# EasyEDA Pro project ProDoc_v03_01_GLUE_LOGIC_4Plane_2026-09-14.epro

# Board v03_01_GLUE_LOGIC_4Plane
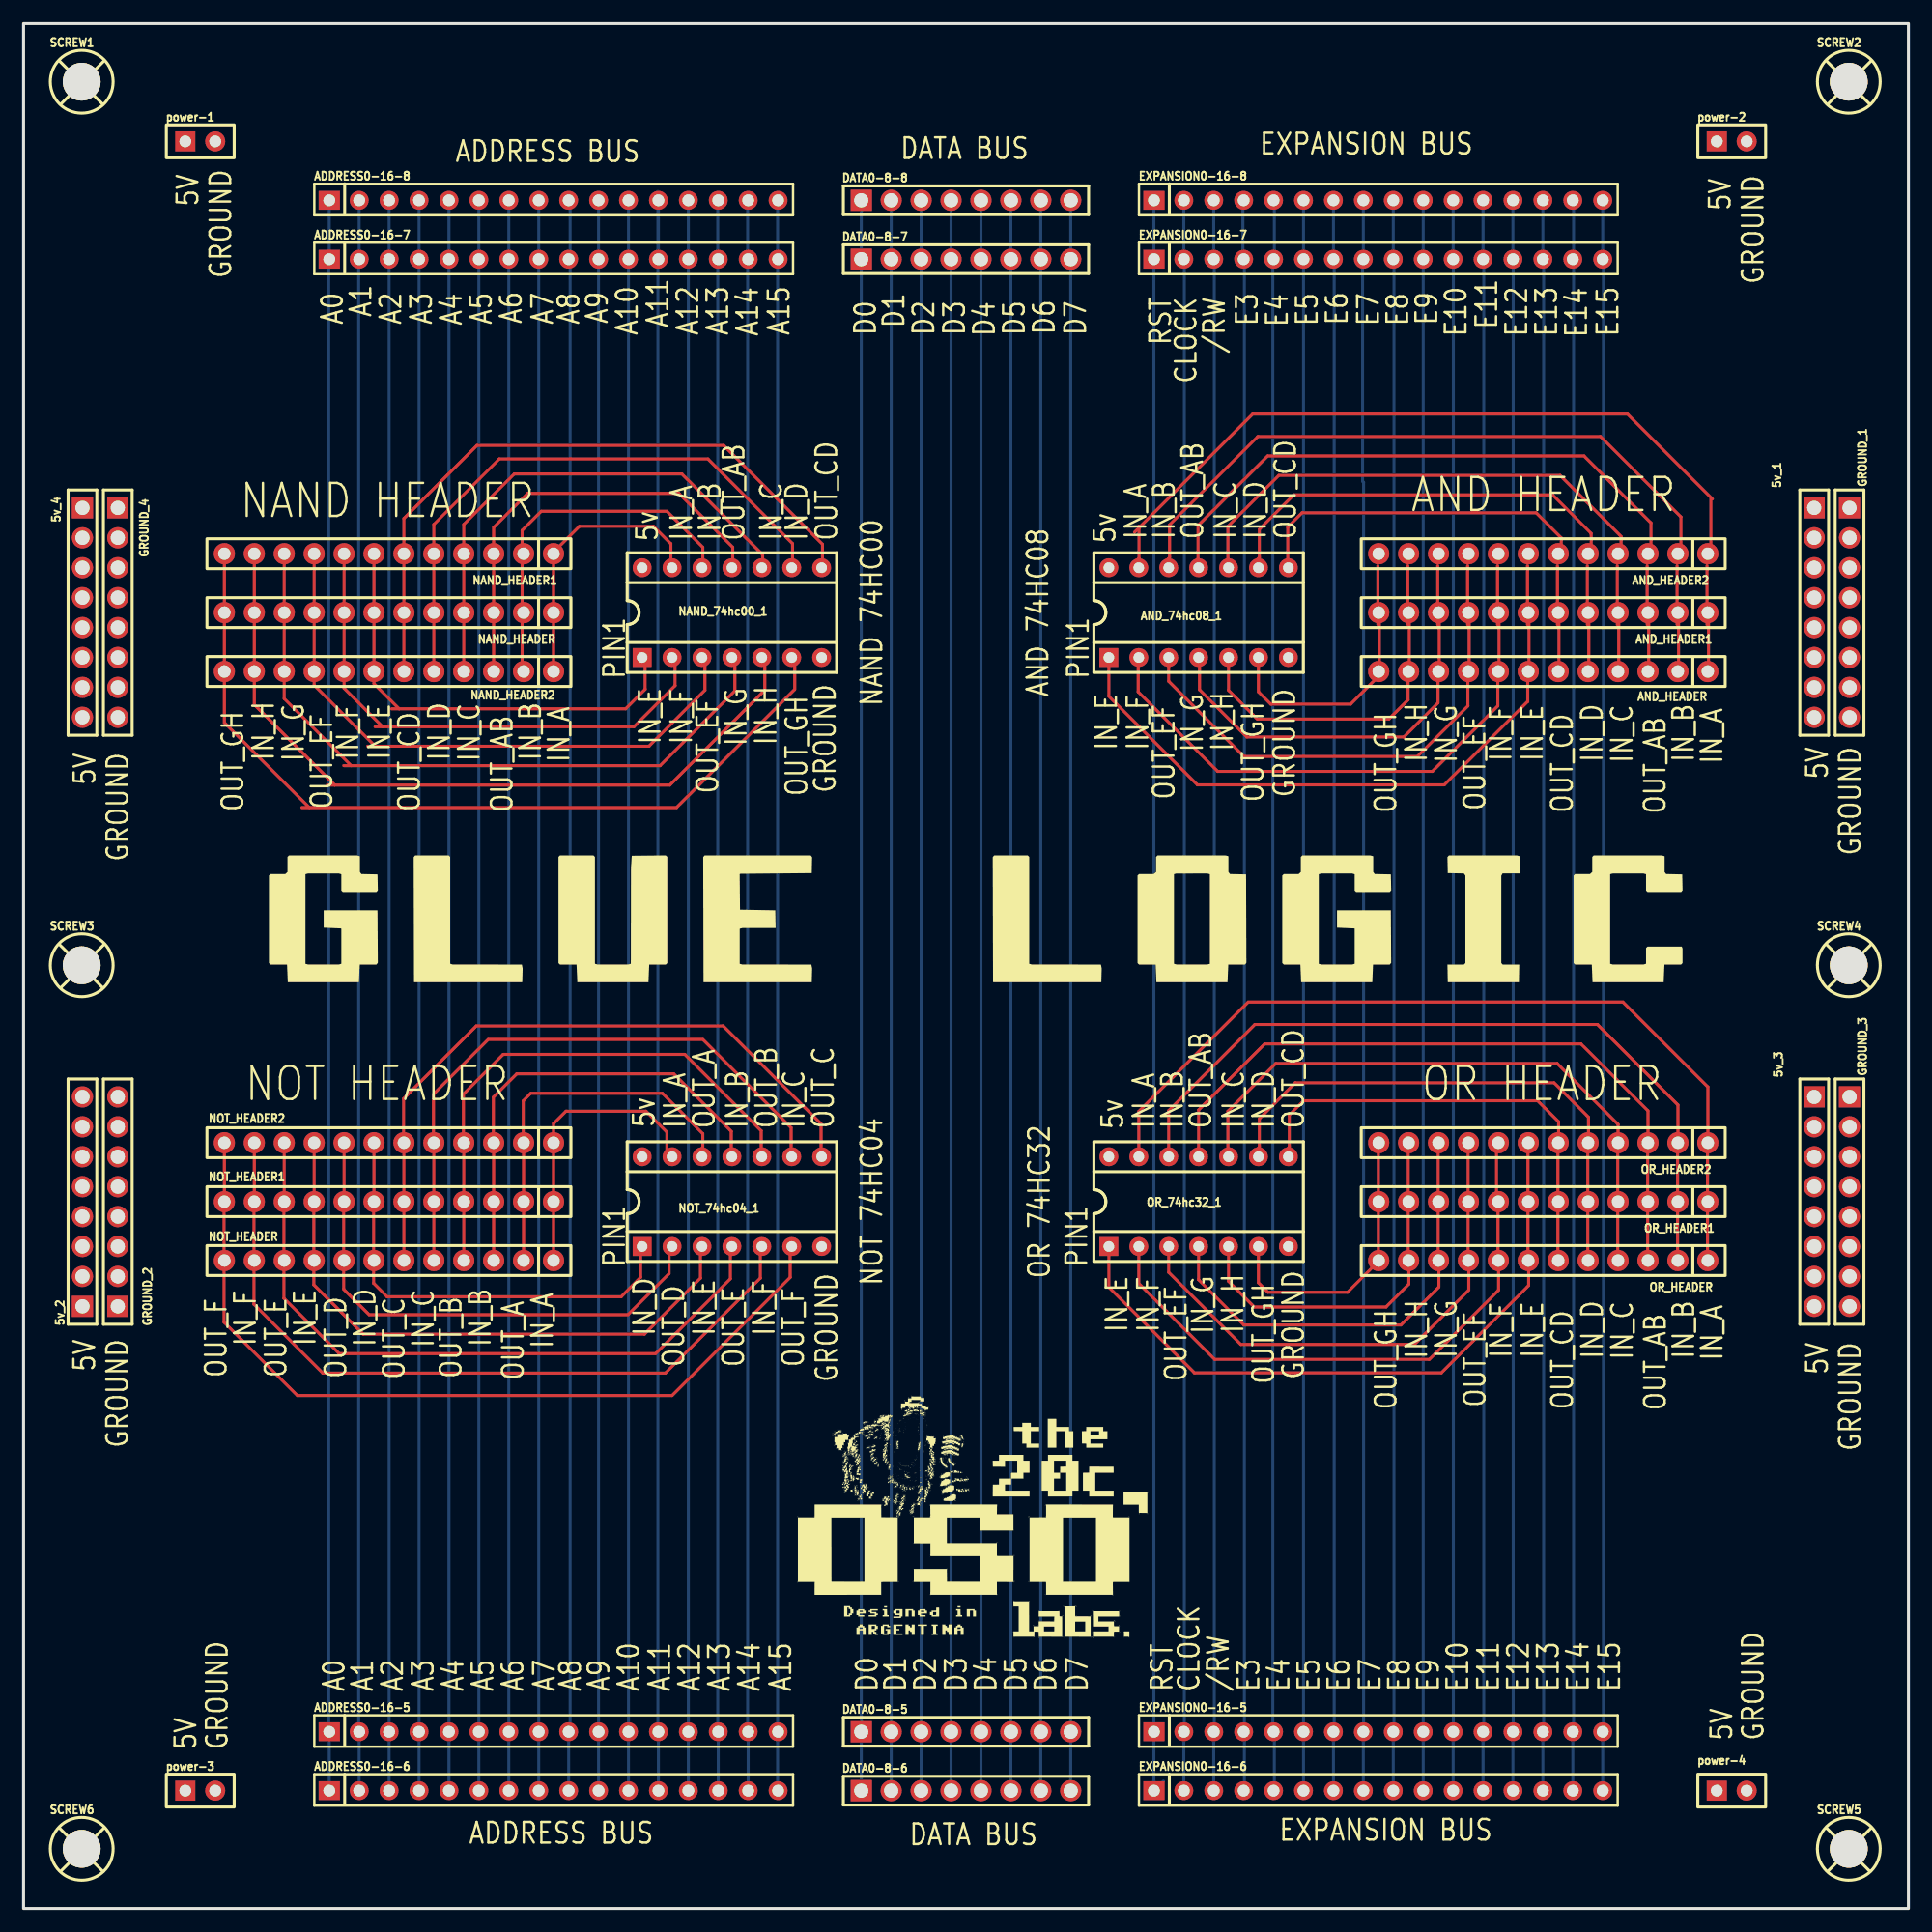
[diagram p0: board, top side]
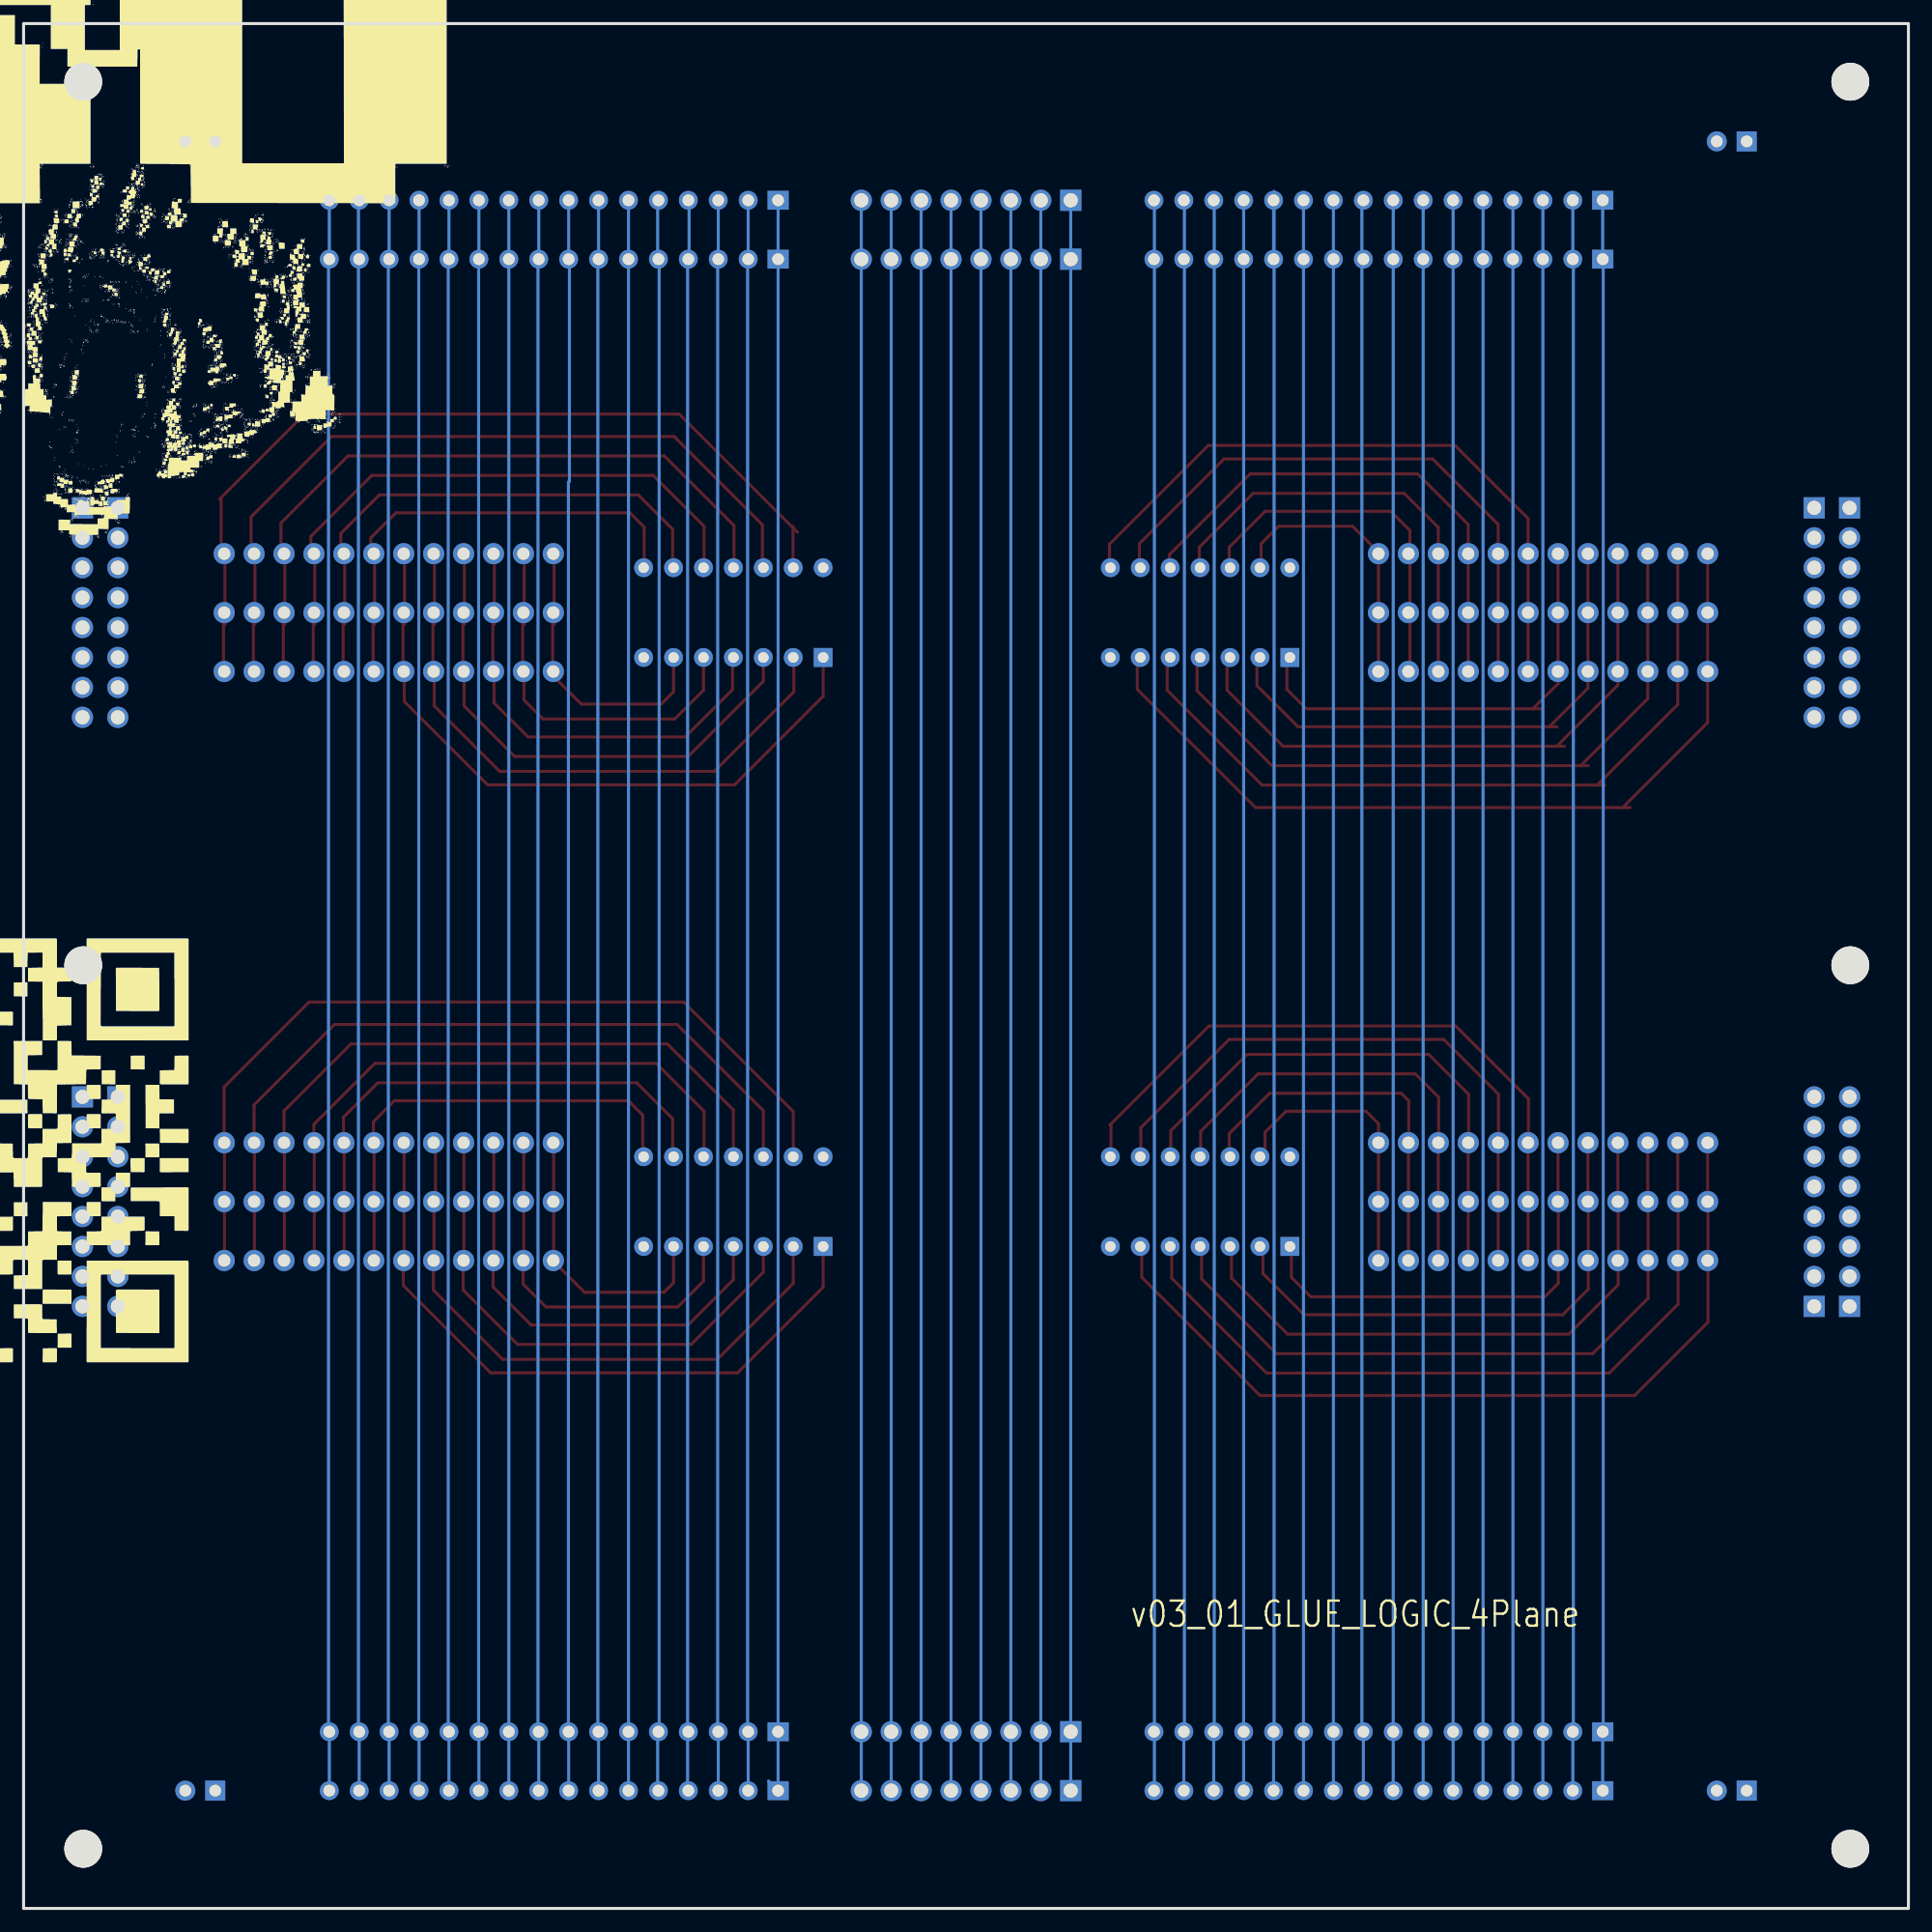
[diagram p1: board, bottom side, seen from below]

Outline 160 x 160 mm; copper layers: Top Layer, GROUND, 5V, Bottom Layer. Coordinates in mm from the lower left corner of the outline.
Outline path: rectangle 0,160 160,0
Stack: Top Layer 0.035mm 外层铜厚1oz / Dielectric1 0.2104mm 7628 RC49% 8.6mil / GROUND 0.0152mm 内层铜厚 / Dielectric2 1.065mm 1.1mm H/HOZ 含铜 / 5V 0.0152mm 内层铜厚 / Dielectric3 0.2104mm 7628 RC49% 8.6mil / Bottom Layer 0.035mm 外层铜厚1oz

## Design rules (mm)
template: JLCPCB Capability(Two Layers Board)
spacing copperThickness1oz (default): track to track 0.102, other pairs 0.152 to 0.3
spacing copperThickness2oz: track to track 0.203, other pairs 0.152 to 0.3
track width copperThickness1oz (default): min 0.127, default 0.254, max 2.54
track width copperThickness2oz: min 0.203, default 0.254, max 2.54
differential pair differentialPair (default): width min 0.127, default 0.254, max 2.54; gap min 0.152, default 0.152
via viaSize (default): diameter min 0.5, default 0.61, max 10; hole min 0.3, default 0.305, max 6.3

## Placement (name value [footprint] x y rotation side)
5v_1  2.54-1*8P母环保  [HDR-TH_8P-P2.54-V-F-1]  152 110 270 top
5v_2  2.54-1*8P母环保  [HDR-TH_8P-P2.54-V-F-1]  5 60 90 top
5v_3  2.54-1*8P母环保  [HDR-TH_8P-P2.54-V-F-1]  152 60 270 top
5v_4  2.54-1*8P母环保  [HDR-TH_8P-P2.54-V-F-1]  5 110 270 top
ADDRESS0-16-5  PM254-1-16-Z-8.5  [HDR-TH_16P-P2.54-V-F-A]  45 15 0 top
ADDRESS0-16-6  PM254-1-16-Z-8.5  [HDR-TH_16P-P2.54-V-F-A]  45 10 0 top
ADDRESS0-16-7  PM254-1-16-Z-8.5  [HDR-TH_16P-P2.54-V-F-A]  45 140 0 top
ADDRESS0-16-8  PM254-1-16-Z-8.5  [HDR-TH_16P-P2.54-V-F-A]  45 145 0 top
AND_74hc08_1  IC-14P窄  [DIP-14_L17.8-W10.2-P2.54-BL]  99.75 110 0 top
AND_HEADER  PM254-1-12-Z-8.5  [HDR-TH_12P-P2.54-V-F]  129 105 180 top
AND_HEADER1  PM254-1-12-Z-8.5  [HDR-TH_12P-P2.54-V-F]  129 110 180 top
AND_HEADER2  PM254-1-12-Z-8.5  [HDR-TH_12P-P2.54-V-F]  129 115 180 top
DATA0-8-5  2.54-1*8P母环保  [HDR-TH_8P-P2.54-V-F-1]  80 15 0 top
DATA0-8-6  2.54-1*8P母环保  [HDR-TH_8P-P2.54-V-F-1]  80 10 0 top
DATA0-8-7  2.54-1*8P母环保  [HDR-TH_8P-P2.54-V-F-1]  80 140 0 top
DATA0-8-8  2.54-1*8P母环保  [HDR-TH_8P-P2.54-V-F-1]  80 145 0 top
EXPANSION0-16-5  PM254-1-16-Z-8.5  [HDR-TH_16P-P2.54-V-F-A]  115 15 0 top
EXPANSION0-16-6  PM254-1-16-Z-8.5  [HDR-TH_16P-P2.54-V-F-A]  115 10 0 top
EXPANSION0-16-7  PM254-1-16-Z-8.5  [HDR-TH_16P-P2.54-V-F-A]  115 140 0 top
EXPANSION0-16-8  PM254-1-16-Z-8.5  [HDR-TH_16P-P2.54-V-F-A]  115 145 0 top
GROUND_1  2.54-1*8P母环保  [HDR-TH_8P-P2.54-V-F-1]  155 110 270 top
GROUND_2  2.54-1*8P母环保  [HDR-TH_8P-P2.54-V-F-1]  8 60 90 top
GROUND_3  2.54-1*8P母环保  [HDR-TH_8P-P2.54-V-F-1]  155 60 270 top
GROUND_4  2.54-1*8P母环保  [HDR-TH_8P-P2.54-V-F-1]  8 110 270 top
NAND_74hc00_1  IC-14P窄  [DIP-14_L17.8-W10.2-P2.54-BL]  60.13 110 0 top
NAND_HEADER  PM254-1-12-Z-8.5  [HDR-TH_12P-P2.54-V-F]  31.02 110 180 top
NAND_HEADER1  PM254-1-12-Z-8.5  [HDR-TH_12P-P2.54-V-F]  31.02 115 180 top
NAND_HEADER2  PM254-1-12-Z-8.5  [HDR-TH_12P-P2.54-V-F]  31.02 105 180 top
NOT_74hc04_1  IC-14P窄  [DIP-14_L17.8-W10.2-P2.54-BL]  60.13 60 0 top
NOT_HEADER  PM254-1-12-Z-8.5  [HDR-TH_12P-P2.54-V-F]  31.02 55 180 top
NOT_HEADER1  PM254-1-12-Z-8.5  [HDR-TH_12P-P2.54-V-F]  31.02 60 180 top
NOT_HEADER2  PM254-1-12-Z-8.5  [HDR-TH_12P-P2.54-V-F]  31.02 65 180 top
OR_74hc32_1  IC-14P窄  [DIP-14_L17.8-W10.2-P2.54-BL]  99.75 60 0 top
OR_HEADER  PM254-1-12-Z-8.5  [HDR-TH_12P-P2.54-V-F]  129 55 180 top
OR_HEADER1  PM254-1-12-Z-8.5  [HDR-TH_12P-P2.54-V-F]  129 60 180 top
OR_HEADER2  PM254-1-12-Z-8.5  [HDR-TH_12P-P2.54-V-F]  129 65 180 top
power-1  2.54-1*2P母  [HDR-TH_2P-P2.54-V-F]  15 150 0 top
power-2  2.54-1*2P母  [HDR-TH_2P-P2.54-V-F]  145 150 0 top
power-3  2.54-1*2P母  [HDR-TH_2P-P2.54-V-F]  15 10 0 top
power-4  2.54-1*2P母  [HDR-TH_2P-P2.54-V-F]  145 10 0 top
SCREW1  -  [Screw-Hole-M3]  5 155 0 top
SCREW2  -  [Screw-Hole-M3]  155 155 0 top
SCREW3  -  [Screw-Hole-M3]  5 80 0 top
SCREW4  -  [Screw-Hole-M3]  155 80 0 top
SCREW5  -  [Screw-Hole-M3]  155 5 0 top
SCREW6  -  [Screw-Hole-M3]  5 5 0 top

## Footprints (pads in the part's own frame, mm; a bottom-side part is the same pattern mirrored in y, then rotated)
DIP-14_L17.8-W10.2-P2.54-BL
  rect 1.6x1.6 hole 0.9: 1(-7.62,-3.81)
  round 1.6 hole 0.9: 2(-5.08,-3.81) 3(-2.54,-3.81) 4(0,-3.81) 5(2.54,-3.81) 6(5.08,-3.81) 7(7.62,-3.81) 8(7.62,3.81) 9(5.08,3.81) 10(2.54,3.81) 11(0,3.81) 12(-2.54,3.81) 13(-5.08,3.81) 14(-7.62,3.81)
HDR-TH_2P-P2.54-V-F
  rect 1.7x1.7 hole 1: 1(-1.27,0)
  round 1.7 hole 1: 2(1.27,0)
HDR-TH_8P-P2.54-V-F-1
  rect 1.8x1.8 hole 1.2: 1(-8.89,0)
  round 1.8 hole 1.2: 2(-6.35,0) 3(-3.81,0) 4(-1.27,0) 5(1.27,0) 6(3.81,0) 7(6.35,0) 8(8.89,0)
HDR-TH_12P-P2.54-V-F
  round 1.8 hole 1.05: 1(-13.97,0) 2(-11.43,0) 3(-8.89,0) 4(-6.35,0) 5(-3.81,0) 6(-1.27,0) 7(1.27,0) 8(3.81,0) 9(6.35,0) 10(8.89,0) 11(11.43,0) 12(13.97,0)
HDR-TH_16P-P2.54-V-F-A
  rect 1.8x1.6 hole 1: 1(-19.05,0)
  round 1.6 hole 1: 2(-16.51,0) 3(-13.97,0) 4(-11.43,0) 5(-8.89,0) 6(-6.35,0) 7(-3.81,0) 8(-1.27,0) 9(1.27,0) 10(3.81,0) 11(6.35,0) 12(8.89,0) 13(11.43,0) 14(13.97,0) 15(16.51,0) 16(19.05,0)
Screw-Hole-M3
  round 3.2 hole 3.2: 1(-0.064,0.064)

## Nets
5V: 5v_1.1 5v_1.2 5v_1.3 5v_1.4 5v_1.5 5v_1.6 5v_1.7 5v_1.8 5v_2.1 5v_2.2 5v_2.3 5v_2.4 5v_2.5 5v_2.6 5v_2.7 5v_2.8 5v_3.1 5v_3.2 5v_3.3 5v_3.4 5v_3.5 5v_3.6 5v_3.7 5v_3.8 5v_4.1 5v_4.2 5v_4.3 5v_4.4 5v_4.5 5v_4.6 5v_4.7 5v_4.8 AND_74hc08_1.14 NAND_74hc00_1.14 NOT_74hc04_1.14 OR_74hc32_1.14 power-1.1 power-2.1 power-3.1 power-4.1
A0: ADDRESS0-16-5.1 ADDRESS0-16-6.1 ADDRESS0-16-7.1 ADDRESS0-16-8.1
A1: ADDRESS0-16-5.2 ADDRESS0-16-6.2 ADDRESS0-16-7.2 ADDRESS0-16-8.2
A2: ADDRESS0-16-5.3 ADDRESS0-16-6.3 ADDRESS0-16-7.3 ADDRESS0-16-8.3
A3: ADDRESS0-16-5.4 ADDRESS0-16-6.4 ADDRESS0-16-7.4 ADDRESS0-16-8.4
A4: ADDRESS0-16-5.5 ADDRESS0-16-6.5 ADDRESS0-16-7.5 ADDRESS0-16-8.5
A5: ADDRESS0-16-5.6 ADDRESS0-16-6.6 ADDRESS0-16-7.6 ADDRESS0-16-8.6
A6: ADDRESS0-16-5.7 ADDRESS0-16-6.7 ADDRESS0-16-7.7 ADDRESS0-16-8.7
A7: ADDRESS0-16-5.8 ADDRESS0-16-6.8 ADDRESS0-16-7.8 ADDRESS0-16-8.8
A8: ADDRESS0-16-5.9 ADDRESS0-16-6.9 ADDRESS0-16-7.9 ADDRESS0-16-8.9
A9: ADDRESS0-16-5.10 ADDRESS0-16-6.10 ADDRESS0-16-7.10 ADDRESS0-16-8.10
A10: ADDRESS0-16-5.11 ADDRESS0-16-6.11 ADDRESS0-16-7.11 ADDRESS0-16-8.11
A11: ADDRESS0-16-5.12 ADDRESS0-16-6.12 ADDRESS0-16-7.12 ADDRESS0-16-8.12
A12: ADDRESS0-16-5.13 ADDRESS0-16-6.13 ADDRESS0-16-7.13 ADDRESS0-16-8.13
A13: ADDRESS0-16-5.14 ADDRESS0-16-6.14 ADDRESS0-16-7.14 ADDRESS0-16-8.14
A14: ADDRESS0-16-5.15 ADDRESS0-16-6.15 ADDRESS0-16-7.15 ADDRESS0-16-8.15
A15: ADDRESS0-16-5.16 ADDRESS0-16-6.16 ADDRESS0-16-7.16 ADDRESS0-16-8.16
AND_IN_A: AND_74hc08_1.13 AND_HEADER.1 AND_HEADER1.1 AND_HEADER2.1
AND_IN_B: AND_74hc08_1.12 AND_HEADER.2 AND_HEADER1.2 AND_HEADER2.2
AND_IN_C: AND_74hc08_1.10 AND_HEADER.4 AND_HEADER1.4 AND_HEADER2.4
AND_IN_D: AND_74hc08_1.9 AND_HEADER.5 AND_HEADER1.5 AND_HEADER2.5
AND_IN_E: AND_74hc08_1.1 AND_HEADER.7 AND_HEADER1.7 AND_HEADER2.7
AND_IN_F: AND_74hc08_1.2 AND_HEADER.8 AND_HEADER1.8 AND_HEADER2.8
AND_IN_G: AND_74hc08_1.4 AND_HEADER.10 AND_HEADER1.10 AND_HEADER2.10
AND_IN_H: AND_74hc08_1.5 AND_HEADER.11 AND_HEADER1.11 AND_HEADER2.11
AND_OUT_AB: AND_74hc08_1.11 AND_HEADER.3 AND_HEADER1.3 AND_HEADER2.3
AND_OUT_CD: AND_74hc08_1.8 AND_HEADER.6 AND_HEADER1.6 AND_HEADER2.6
AND_OUT_EF: AND_74hc08_1.3 AND_HEADER.9 AND_HEADER1.9 AND_HEADER2.9
AND_OUT_GH: AND_74hc08_1.6 AND_HEADER.12 AND_HEADER1.12 AND_HEADER2.12
CLOCK: EXPANSION0-16-5.2 EXPANSION0-16-6.2 EXPANSION0-16-7.2 EXPANSION0-16-8.2
D0: DATA0-8-5.1 DATA0-8-6.1 DATA0-8-7.1 DATA0-8-8.1
D1: DATA0-8-5.2 DATA0-8-6.2 DATA0-8-7.2 DATA0-8-8.2
D2: DATA0-8-5.3 DATA0-8-6.3 DATA0-8-7.3 DATA0-8-8.3
D3: DATA0-8-5.4 DATA0-8-6.4 DATA0-8-7.4 DATA0-8-8.4
D4: DATA0-8-5.5 DATA0-8-6.5 DATA0-8-7.5 DATA0-8-8.5
D5: DATA0-8-5.6 DATA0-8-6.6 DATA0-8-7.6 DATA0-8-8.6
D6: DATA0-8-5.7 DATA0-8-6.7 DATA0-8-7.7 DATA0-8-8.7
D7: DATA0-8-5.8 DATA0-8-6.8 DATA0-8-7.8 DATA0-8-8.8
E3: EXPANSION0-16-5.4 EXPANSION0-16-6.4 EXPANSION0-16-7.4 EXPANSION0-16-8.4
E4: EXPANSION0-16-5.5 EXPANSION0-16-6.5 EXPANSION0-16-7.5 EXPANSION0-16-8.5
E5: EXPANSION0-16-5.6 EXPANSION0-16-6.6 EXPANSION0-16-7.6 EXPANSION0-16-8.6
E6: EXPANSION0-16-5.7 EXPANSION0-16-6.7 EXPANSION0-16-7.7 EXPANSION0-16-8.7
E7: EXPANSION0-16-5.8 EXPANSION0-16-6.8 EXPANSION0-16-7.8 EXPANSION0-16-8.8
E8: EXPANSION0-16-5.9 EXPANSION0-16-6.9 EXPANSION0-16-7.9 EXPANSION0-16-8.9
E9: EXPANSION0-16-5.10 EXPANSION0-16-6.10 EXPANSION0-16-7.10 EXPANSION0-16-8.10
E10: EXPANSION0-16-5.11 EXPANSION0-16-6.11 EXPANSION0-16-7.11 EXPANSION0-16-8.11
E11: EXPANSION0-16-5.12 EXPANSION0-16-6.12 EXPANSION0-16-7.12 EXPANSION0-16-8.12
E12: EXPANSION0-16-5.13 EXPANSION0-16-6.13 EXPANSION0-16-7.13 EXPANSION0-16-8.13
E13: EXPANSION0-16-5.14 EXPANSION0-16-6.14 EXPANSION0-16-7.14 EXPANSION0-16-8.14
E14: EXPANSION0-16-5.15 EXPANSION0-16-6.15 EXPANSION0-16-7.15 EXPANSION0-16-8.15
E15: EXPANSION0-16-5.16 EXPANSION0-16-6.16 EXPANSION0-16-7.16 EXPANSION0-16-8.16
GROUND: AND_74hc08_1.7 GROUND_1.1 GROUND_1.2 GROUND_1.3 GROUND_1.4 GROUND_1.5 GROUND_1.6 GROUND_1.7 GROUND_1.8 GROUND_2.1 GROUND_2.2 GROUND_2.3 GROUND_2.4 GROUND_2.5 GROUND_2.6 GROUND_2.7 GROUND_2.8 GROUND_3.1 GROUND_3.2 GROUND_3.3 GROUND_3.4 GROUND_3.5 GROUND_3.6 GROUND_3.7 GROUND_3.8 GROUND_4.1 GROUND_4.2 GROUND_4.3 GROUND_4.4 GROUND_4.5 GROUND_4.6 GROUND_4.7 GROUND_4.8 NAND_74hc00_1.7 NOT_74hc04_1.7 OR_74hc32_1.7 power-1.2 power-2.2 power-3.2 power-4.2
NAND_IN_A: NAND_74hc00_1.13 NAND_HEADER.1 NAND_HEADER1.1 NAND_HEADER2.1
NAND_IN_B: NAND_74hc00_1.12 NAND_HEADER.2 NAND_HEADER1.2 NAND_HEADER2.2
NAND_IN_C: NAND_74hc00_1.10 NAND_HEADER.4 NAND_HEADER1.4 NAND_HEADER2.4
NAND_IN_D: NAND_74hc00_1.9 NAND_HEADER.5 NAND_HEADER1.5 NAND_HEADER2.5
NAND_IN_E: NAND_74hc00_1.1 NAND_HEADER.7 NAND_HEADER1.7 NAND_HEADER2.7
NAND_IN_F: NAND_74hc00_1.2 NAND_HEADER.8 NAND_HEADER1.8 NAND_HEADER2.8
NAND_IN_G: NAND_74hc00_1.4 NAND_HEADER.10 NAND_HEADER1.10 NAND_HEADER2.10
NAND_IN_H: NAND_74hc00_1.5 NAND_HEADER.11 NAND_HEADER1.11 NAND_HEADER2.11
NAND_OUT_AB: NAND_74hc00_1.11 NAND_HEADER.3 NAND_HEADER1.3 NAND_HEADER2.3
NAND_OUT_CD: NAND_74hc00_1.8 NAND_HEADER.6 NAND_HEADER1.6 NAND_HEADER2.6
NAND_OUT_EF: NAND_74hc00_1.3 NAND_HEADER.9 NAND_HEADER1.9 NAND_HEADER2.9
NAND_OUT_GH: NAND_74hc00_1.6 NAND_HEADER.12 NAND_HEADER1.12 NAND_HEADER2.12
NOT_IN_A: NOT_74hc04_1.13 NOT_HEADER.1 NOT_HEADER1.1 NOT_HEADER2.1
NOT_IN_B: NOT_74hc04_1.11 NOT_HEADER.3 NOT_HEADER1.3 NOT_HEADER2.3
NOT_IN_C: NOT_74hc04_1.9 NOT_HEADER.5 NOT_HEADER1.5 NOT_HEADER2.5
NOT_IN_D: NOT_74hc04_1.1 NOT_HEADER.7 NOT_HEADER1.7 NOT_HEADER2.7
NOT_IN_E: NOT_74hc04_1.3 NOT_HEADER.9 NOT_HEADER1.9 NOT_HEADER2.9
NOT_IN_F: NOT_74hc04_1.5 NOT_HEADER.11 NOT_HEADER1.11 NOT_HEADER2.11
NOT_OUT_A: NOT_74hc04_1.12 NOT_HEADER.2 NOT_HEADER1.2 NOT_HEADER2.2
NOT_OUT_B: NOT_74hc04_1.10 NOT_HEADER.4 NOT_HEADER1.4 NOT_HEADER2.4
NOT_OUT_C: NOT_74hc04_1.8 NOT_HEADER.6 NOT_HEADER1.6 NOT_HEADER2.6
NOT_OUT_D: NOT_74hc04_1.2 NOT_HEADER.8 NOT_HEADER1.8 NOT_HEADER2.8
NOT_OUT_E: NOT_74hc04_1.4 NOT_HEADER.10 NOT_HEADER1.10 NOT_HEADER2.10
NOT_OUT_F: NOT_74hc04_1.6 NOT_HEADER.12 NOT_HEADER1.12 NOT_HEADER2.12
OR_IN_A: OR_74hc32_1.13 OR_HEADER.1 OR_HEADER1.1 OR_HEADER2.1
OR_IN_B: OR_74hc32_1.12 OR_HEADER.2 OR_HEADER1.2 OR_HEADER2.2
OR_IN_C: OR_74hc32_1.10 OR_HEADER.4 OR_HEADER1.4 OR_HEADER2.4
OR_IN_D: OR_74hc32_1.9 OR_HEADER.5 OR_HEADER1.5 OR_HEADER2.5
OR_IN_E: OR_74hc32_1.1 OR_HEADER.7 OR_HEADER1.7 OR_HEADER2.7
OR_IN_F: OR_74hc32_1.2 OR_HEADER.8 OR_HEADER1.8 OR_HEADER2.8
OR_IN_G: OR_74hc32_1.4 OR_HEADER.10 OR_HEADER1.10 OR_HEADER2.10
OR_IN_H: OR_74hc32_1.5 OR_HEADER.11 OR_HEADER1.11 OR_HEADER2.11
OR_OUT_AB: OR_74hc32_1.11 OR_HEADER.3 OR_HEADER1.3 OR_HEADER2.3
OR_OUT_CD: OR_74hc32_1.8 OR_HEADER.6 OR_HEADER1.6 OR_HEADER2.6
OR_OUT_EF: OR_74hc32_1.3 OR_HEADER.9 OR_HEADER1.9 OR_HEADER2.9
OR_OUT_GH: OR_74hc32_1.6 OR_HEADER.12 OR_HEADER1.12 OR_HEADER2.12
RST: EXPANSION0-16-5.1 EXPANSION0-16-6.1 EXPANSION0-16-7.1 EXPANSION0-16-8.1
RW: EXPANSION0-16-5.3 EXPANSION0-16-6.3 EXPANSION0-16-7.3 EXPANSION0-16-8.3

Pads without a net: SCREW1 1; SCREW2 1; SCREW3 1; SCREW4 1; SCREW5 1; SCREW6 1

## Routing (per net, layer and track width the routed paths; a pad name or vN(x,y) marks a point on that pad's centre or on a via; arc(x,y) is an arc through that point)
A0: length 135
  Bottom Layer w0.254: ADDRESS0-16-7.1 ADDRESS0-16-8.1 ; 25.91,139.97 25.91,14.97 ; ADDRESS0-16-5.1 ADDRESS0-16-6.1
A1: length 134.8
  Bottom Layer w0.254: 28.45,139.85 28.45,14.85 ; ADDRESS0-16-7.2 28.49,144.87 28.62,145 ; 28.49,14.75 ADDRESS0-16-6.2
A2: length 135
  Bottom Layer w0.254: ADDRESS0-16-6.3 ADDRESS0-16-5.3 ADDRESS0-16-7.3 ADDRESS0-16-8.3
A3: length 135.1
  Bottom Layer w0.254: ADDRESS0-16-6.4 ADDRESS0-16-7.4 33.57,144.87 ; 33.7,144.87 ADDRESS0-16-8.4
A4: length 135
  Bottom Layer w0.254: ADDRESS0-16-6.5 ADDRESS0-16-7.5 ADDRESS0-16-8.5
A5: length 135.1
  Bottom Layer w0.254: ADDRESS0-16-6.6 ADDRESS0-16-7.6 38.65,144.87 38.78,145
A6: length 135
  Bottom Layer w0.254: ADDRESS0-16-6.7 ADDRESS0-16-5.7 ADDRESS0-16-7.7 ADDRESS0-16-8.7
A7: length 135.1
  Bottom Layer w0.254: ADDRESS0-16-6.8 ADDRESS0-16-7.8 43.73,144.87 43.86,145
A8: length 135.1
  Bottom Layer w0.254: ADDRESS0-16-6.9 46.27,14.62 ; 46.4,14.62 46.4,144.87 ADDRESS0-16-8.9
A9: length 134.8
  Bottom Layer w0.254: ADDRESS0-16-8.10 ADDRESS0-16-7.10 48.81,15.13 49.02,14.91 ; ADDRESS0-16-6.10 48.81,14.62
A10: length 135
  Bottom Layer w0.254: ADDRESS0-16-8.11 ADDRESS0-16-7.11 ADDRESS0-16-5.11 ADDRESS0-16-6.11
A11: length 140.1
  Bottom Layer w0.254: ADDRESS0-16-7.12 ADDRESS0-16-8.12 ; 53.89,14.75 ADDRESS0-16-6.12 ; 53.85,145.75 53.85,15.47 53.9,15.42
A12: length 134.2
  Bottom Layer w0.254: ADDRESS0-16-7.13 ADDRESS0-16-8.13 ; 56.43,139.15 ADDRESS0-16-5.13 ADDRESS0-16-6.13 56.39,10.04
A13: length 134.9
  Bottom Layer w0.254: 58.97,14.37 58.97,10.25 59.22,10 ; 59.1,145 58.93,144.83 58.93,15.04 59.22,14.75
A14: length 135
  Bottom Layer w0.254: ADDRESS0-16-6.15 61.51,14.62 61.46,14.67 61.46,144.95 ADDRESS0-16-8.15
A15: length 135
  Bottom Layer w0.254: ADDRESS0-16-6.16 64.01,10.04 64.01,144.96 ADDRESS0-16-8.16
AND_IN_A: length 74
  Top Layer w0.254: 143.23,119.64 143.23,115.31 ; 143.35,119.64 136.14,126.85 104.34,126.85 94.69,117.2 ; 94.18,114.11 94.69,114.62 94.69,117.2 ; 143.03,109.41 143.03,104.41 ; 94.69,117.2 94.69,117.33 ; 94.69,117.2 94.31,116.82 ; 142.9,113.98 142.9,108.98
AND_IN_B: length 65.7
  Top Layer w0.254: 140.36,113.98 140.36,108.98 ; 140.49,109.41 140.49,104.41 ; 140.69,115.31 140.69,118.12 133.86,124.95 104.78,124.95 97.28,117.45 97.28,114.68 96.72,114.11
AND_IN_C: length 51.9
  Top Layer w0.254: 135.61,115.31 135.61,116.47 130.43,121.65 106.55,121.65 102.24,117.33 102.24,114.55 101.8,114.11 ; 135.28,113.98 135.28,108.98 ; 135.41,109.41 135.41,104.41
AND_IN_D: length 45.3
  Top Layer w0.254: 132.74,113.98 132.74,108.98 ; 133.07,115.31 133.07,116.72 129.79,120 107.82,120 104.9,117.07 104.9,114.68 104.34,114.11 ; 132.87,109.41 132.87,104.41
AND_IN_E: length 57
  Top Layer w0.254: 127.79,104.41 127.79,109.41 ; 127.66,108.98 127.66,113.98 ; 127.68,104.56 127.68,102.46 120.6,95.38 99.65,95.38 92.13,102.9 AND_74hc08_1.1
AND_IN_F: length 51.1
  Top Layer w0.254: 125.25,109.41 125.25,104.41 ; 125.12,113.98 125.12,108.98 ; AND_74hc08_1.2 94.62,106.14 94.62,103.27 101.37,96.52 119.58,96.52 125.14,102.08 125.14,104.56
AND_IN_G: length 38.1
  Top Layer w0.254: 120.04,113.98 120.04,108.98 ; 120.06,104.56 120.06,102.33 117.17,99.44 103.84,99.44 99.82,103.45 99.82,106.11 AND_74hc08_1.4 ; 120.17,109.41 120.17,104.41
AND_IN_H: length 31.7
  Top Layer w0.254: AND_74hc08_1.5 102.29,103.4 104.73,100.96 115.9,100.96 117.52,102.59 117.52,104.56 ; 117.5,113.98 117.5,108.98 ; 117.63,109.41 117.63,104.41
AND_OUT_AB: length 59
  Top Layer w0.254: 137.95,109.41 137.95,104.41 ; 99.26,114.11 99.69,114.55 99.69,117.38 105.61,123.3 132.46,123.3 138.15,117.61 138.15,115.31 ; 137.82,113.98 137.82,108.98
AND_OUT_CD: length 39
  Top Layer w0.254: 130.2,113.98 130.2,108.98 ; 130.33,109.41 130.33,104.41 ; 106.88,114.11 107.31,114.55 107.31,117.26 108.53,118.47 128.4,118.47 130.53,116.34 130.53,115.31
AND_OUT_EF: length 44.3
  Top Layer w0.254: 122.58,108.98 122.58,113.98 ; 122.6,104.56 122.6,102.08 118.31,97.79 103.58,97.79 97.21,104.17 AND_74hc08_1.3 ; 122.71,104.41 122.71,109.41
AND_OUT_GH: length 24.5
  Top Layer w0.254: 114.96,113.98 114.96,108.98 ; AND_74hc08_1.6 104.83,103.28 105.87,102.23 112.66,102.23 114.98,104.56 ; 115.09,109.41 115.09,104.41
CLOCK: length 134.2
  Bottom Layer w0.254: 98.54,15.81 98.54,139.95 EXPANSION0-16-7.2 EXPANSION0-16-8.2 ; EXPANSION0-16-6.2 EXPANSION0-16-5.2
D0: length 135
  Bottom Layer w0.254: DATA0-8-6.1 DATA0-8-5.1 DATA0-8-7.1 DATA0-8-8.1
D1: length 135
  Bottom Layer w0.254: DATA0-8-6.2 DATA0-8-5.2 DATA0-8-7.2 DATA0-8-8.2
D2: length 135
  Bottom Layer w0.254: DATA0-8-6.3 DATA0-8-5.3 DATA0-8-7.3 DATA0-8-8.3
D3: length 135.3
  Bottom Layer w0.254: 78.53,10.2 DATA0-8-6.4 DATA0-8-5.4 DATA0-8-7.4 DATA0-8-8.4
D4: length 135
  Bottom Layer w0.254: DATA0-8-6.5 DATA0-8-5.5 DATA0-8-7.5 DATA0-8-8.5
D5: length 135.3
  Bottom Layer w0.254: DATA0-8-6.6 DATA0-8-5.6 DATA0-8-7.6 DATA0-8-8.6 ; 83.86,10.2 84.06,10
D6: length 135
  Bottom Layer w0.254: DATA0-8-6.7 DATA0-8-5.7 DATA0-8-7.7 DATA0-8-8.7
D7: length 135
  Bottom Layer w0.254: DATA0-8-6.8 DATA0-8-5.8 DATA0-8-7.8 DATA0-8-8.8
E3: length 135
  Bottom Layer w0.254: 103.5,144.85 103.5,139.85 ; 103.63,10.11 103.63,15.11 ; 103.63,140.17 103.63,15.17
E4: length 135
  Bottom Layer w0.254: 106.17,144.98 106.17,139.98 ; 106.04,140.04 106.04,15.04 ; 106.17,10.2 106.17,15.2
E5: length 135
  Bottom Layer w0.254: EXPANSION0-16-6.6 EXPANSION0-16-5.6 EXPANSION0-16-7.6 EXPANSION0-16-8.6
E6: length 135.4
  Bottom Layer w0.254: EXPANSION0-16-6.7 EXPANSION0-16-5.7 110.74,15.45 ; EXPANSION0-16-8.7 EXPANSION0-16-7.7 110.74,139.55 ; 111.25,139.55 111.25,15.45
E7: length 135.1
  Bottom Layer w0.254: EXPANSION0-16-8.8 EXPANSION0-16-7.8 ; EXPANSION0-16-6.8 EXPANSION0-16-5.8 113.75,15.02 113.75,121.06 113.66,121.15 113.66,139.94 113.6,140
E8: length 134.2
  Bottom Layer w0.254: EXPANSION0-16-7.9 EXPANSION0-16-8.9 ; 116.33,139.17 116.33,15.06 EXPANSION0-16-5.9 EXPANSION0-16-6.9
E9: length 135
  Bottom Layer w0.254: EXPANSION0-16-8.10 EXPANSION0-16-7.10 EXPANSION0-16-5.10 EXPANSION0-16-6.10
E10: length 135
  Bottom Layer w0.254: EXPANSION0-16-8.11 EXPANSION0-16-7.11 121.37,139.98 121.37,15.02 EXPANSION0-16-5.11 EXPANSION0-16-6.11
E11: length 135.1
  Bottom Layer w0.254: EXPANSION0-16-6.12 EXPANSION0-16-5.12 123.95,15.06 123.95,139.94 EXPANSION0-16-7.12 EXPANSION0-16-8.12
E12: length 135
  Bottom Layer w0.254: EXPANSION0-16-8.13 EXPANSION0-16-7.13 126.45,139.98 126.45,15.02 EXPANSION0-16-5.13 EXPANSION0-16-6.13
E13: length 134.2
  Bottom Layer w0.254: 129.03,139.17 129.03,15.06 EXPANSION0-16-5.14 EXPANSION0-16-6.14 ; EXPANSION0-16-8.14 EXPANSION0-16-7.14
E14: length 135.1
  Bottom Layer w0.254: EXPANSION0-16-8.15 131.57,144.94 131.57,15.06 EXPANSION0-16-5.15 EXPANSION0-16-6.15
E15: length 134.2
  Bottom Layer w0.254: EXPANSION0-16-8.16 EXPANSION0-16-7.16 ; EXPANSION0-16-6.16 EXPANSION0-16-5.16 134.11,15.06 134.11,139.2
NAND_IN_A: length 23.8
  Top Layer w0.254: 55.3,113.81 54.95,114.16 54.95,115.84 53.47,117.33 47.19,117.33 44.86,115 ; NAND_HEADER1.1 NAND_HEADER.1 NAND_HEADER2.1
NAND_IN_B: length 30.8
  Top Layer w0.254: 57.66,113.99 57.66,115.55 54.61,118.6 43.94,118.6 42.32,116.97 42.32,115 ; 42.32,105 42.32,115 ; 42.29,115.03 42.32,115
NAND_IN_C: length 43.7
  Top Layer w0.254: 63.05,113.81 62.74,114.12 62.74,114.92 55.88,121.77 41.66,121.77 37.37,117.48 NAND_HEADER1.4 NAND_HEADER.4 NAND_HEADER2.4
NAND_IN_D: length 50.4
  Top Layer w0.254: 65.59,113.81 65.28,114.12 65.28,115.86 58.09,123.04 40.39,123.04 34.83,117.48 NAND_HEADER1.5 NAND_HEADER.5 NAND_HEADER2.5
NAND_IN_E: length 39
  Top Layer w0.254: 31.88,101.83 51.11,101.83 52.76,103.48 52.76,106.19 ; 31.88,101.83 29.75,103.97 NAND_HEADER2.7 NAND_HEADER.7 NAND_HEADER1.7 ; 31.88,101.83 31.24,101.83
NAND_IN_F: length 45.3
  Top Layer w0.254: NAND_HEADER1.8 NAND_HEADER.8 NAND_HEADER2.8 27.21,103.58 30.48,100.31 ; 30.48,100.31 51.82,100.31 55.3,103.8 55.3,106.19 ; 30.48,100.31 29.84,100.31
NAND_IN_G: length 59
  Top Layer w0.254: 27.81,97.01 27.18,97.01 ; 27.81,97.01 54.03,97.01 60.38,103.36 60.38,106.19 ; 27.81,97.01 22.13,102.69 NAND_HEADER2.10 NAND_HEADER.10 NAND_HEADER1.10
NAND_IN_H: length 65.7
  Top Layer w0.254: 26.42,95.36 19.59,102.19 NAND_HEADER2.11 NAND_HEADER.11 NAND_HEADER1.11 ; 26.42,95.36 54.86,95.36 62.92,103.41 62.92,106.19 ; 26.42,95.36 25.78,95.36
NAND_OUT_AB: length 37.5
  Top Layer w0.254: NAND_HEADER2.3 NAND_HEADER.3 NAND_HEADER1.3 39.91,117.23 42.8,120.12 55.63,120.12 60.2,115.55 60.2,114.12 60.51,113.81
NAND_OUT_CD: length 55.7
  Top Layer w0.254: 67.82,114.66 67.82,115.8 59.44,124.19 38.48,124.19 32.29,117.99 NAND_HEADER1.6 NAND_HEADER.6 NAND_HEADER2.6
NAND_OUT_EF: length 51.9
  Top Layer w0.254: 29.84,98.66 53.09,98.66 57.84,103.41 57.84,106.19 ; 29.84,98.66 24.67,103.84 NAND_HEADER2.9 NAND_HEADER.9 NAND_HEADER1.9 ; 29.84,98.66 29.21,98.66
NAND_OUT_GH: length 73.2
  Top Layer w0.254: NAND_HEADER1.12 NAND_HEADER.12 NAND_HEADER2.12 17.05,100.66 24.26,93.45 ; 24.26,93.45 55.43,93.45 65.46,103.48 65.46,106.19 ; 24.26,93.45 23.62,93.45
NOT_IN_A: length 24.2
  Top Layer w0.254: 54.67,64.15 54.61,64.21 54.61,65.89 52.83,67.67 46.04,67.67 44.99,66.61 NOT_HEADER2.1 NOT_HEADER1.1 NOT_HEADER.1
NOT_IN_B: length 38.3
  Top Layer w0.254: 60.08,64.53 60.08,65.96 55.19,70.85 41.86,70.85 39.88,68.86 39.88,65.03 NOT_HEADER2.3 ; 39.91,59.37 39.91,54.37 ; 39.91,64.58 39.91,59.58
NOT_IN_C: length 50.8
  Top Layer w0.254: 65.16,64.53 65.16,66.27 57.66,73.77 39.45,73.77 34.8,69.12 34.8,65.03 NOT_HEADER2.5 ; NOT_HEADER.5 NOT_HEADER1.5 34.83,64.58
NOT_IN_D: length 38.5
  Top Layer w0.254: 52.38,56.28 52.38,53.57 50.73,51.92 30.86,51.92 29.72,53.07 29.72,59.97 NOT_HEADER1.7 ; NOT_HEADER1.7 29.75,64.58 ; NOT_HEADER1.7 29.75,59.58
NOT_IN_E: length 51.4
  Top Layer w0.254: 24.67,59.58 NOT_HEADER1.9 ; NOT_HEADER1.9 24.64,59.97 24.64,52.94 28.83,48.75 52.7,48.75 57.46,53.5 57.46,56.28 ; NOT_HEADER1.9 24.67,64.58
NOT_IN_F: length 65.2
  Top Layer w0.254: NOT_HEADER1.11 19.59,59.58 ; NOT_HEADER1.11 19.59,64.58 ; NOT_HEADER1.11 19.56,59.97 19.56,51.29 25.4,45.45 54.48,45.45 62.54,53.5 62.54,56.28
NOT_OUT_A: length 31.9
  Top Layer w0.254: 42.45,59.37 42.45,54.37 ; NOT_HEADER2.2 42.42,65.03 42.42,68.56 43.05,69.19 54.23,69.19 57.66,65.77 57.66,64.61 57.46,64.41 ; 42.45,64.58 42.45,59.58
NOT_OUT_B: length 45
  Top Layer w0.254: 62.62,64.53 62.62,66.01 56.13,72.5 40.72,72.5 37.34,69.12 37.34,65.03 NOT_HEADER2.4 ; 37.37,64.58 37.37,59.58 ; 37.37,59.5 37.37,54.5
NOT_OUT_C: length 56.9
  Top Layer w0.254: NOT_HEADER.6 NOT_HEADER1.6 32.29,64.58 ; 67.7,64.53 67.7,66.46 67.77,66.53 59.39,74.91 38.43,74.91 32.26,68.74 32.26,65.03 NOT_HEADER2.6
NOT_OUT_D: length 44.5
  Top Layer w0.254: 27.18,60 27.18,59.9 ; 27.18,59.9 27.08,60 ; 27.18,59.9 27.18,52.56 29.34,50.4 51.31,50.4 54.79,53.88 54.79,56.28 ; 27.21,64.58 NOT_HEADER1.8
NOT_OUT_E: length 58.5
  Top Layer w0.254: NOT_HEADER1.10 22.1,59.97 22.1,51.8 26.8,47.1 53.65,47.1 60,53.45 60,56.28 ; NOT_HEADER1.10 22.13,64.58 ; NOT_HEADER1.10 22.13,59.58
NOT_OUT_F: length 72.7
  Top Layer w0.254: NOT_HEADER2.12 NOT_HEADER1.12 17.02,59.97 17.02,49.76 23.24,43.54 55.05,43.54 65.08,53.57 65.08,56.28
OR_IN_A: length 73.3
  Top Layer w0.254: 142.94,60.63 142.94,65.63 ; 142.94,55.29 142.94,60.29 ; 142.97,65.39 142.97,69.73 135.76,76.94 103.96,76.94 94.67,67.65 OR_74hc32_1.13
OR_IN_B: length 65.8
  Top Layer w0.254: 140.43,65.39 140.43,68.21 133.6,75.04 104.52,75.04 97.21,67.72 OR_74hc32_1.12 ; 140.4,55.29 140.4,60.29 ; 140.4,60.63 140.4,65.63
OR_IN_C: length 52
  Top Layer w0.254: OR_74hc32_1.10 102.24,63.86 102.24,67.67 106.3,71.73 130.18,71.73 135.35,66.56 135.35,65.39 ; 135.32,65.63 135.32,60.63 ; 135.32,60.29 135.32,55.29
OR_IN_D: length 45.3
  Top Layer w0.254: 133.19,65.39 132.84,65.75 132.84,67.16 129.92,70.08 107.95,70.08 104.9,67.04 104.9,64.64 104.47,64.2 ; 132.78,55.29 132.78,60.29 ; 132.78,60.63 132.78,65.63
OR_IN_E: length 57.1
  Top Layer w0.254: 127.7,55.29 127.7,60.29 ; OR_74hc32_1.1 92.13,52.73 99.39,45.47 120.35,45.47 127.76,52.88 127.76,54.32 127.43,54.65 ; 127.7,60.63 127.7,65.63
OR_IN_F: length 51.1
  Top Layer w0.254: 125.16,55.29 125.16,60.29 ; OR_74hc32_1.2 94.67,53.06 101.11,46.61 119.33,46.61 125.21,52.49 125.21,54.33 124.89,54.65 ; 125.03,60.63 125.03,65.63
OR_IN_G: length 38.2
  Top Layer w0.254: 119.81,54.65 120.14,54.32 120.14,52.75 116.92,49.53 103.58,49.53 99.75,53.37 OR_74hc32_1.4 ; 120.08,55.29 120.08,60.29 ; 120.08,60.63 120.08,65.63
OR_IN_H: length 31.8
  Top Layer w0.254: 117.54,60.63 117.54,65.63 ; 117.27,54.65 117.59,54.33 117.59,53 115.65,51.05 104.47,51.05 102.29,53.24 OR_74hc32_1.5 ; 117.54,55.29 117.54,60.29
OR_OUT_AB: length 59.1
  Top Layer w0.254: 137.86,55.29 137.86,60.29 ; 137.86,60.63 137.86,65.63 ; OR_74hc32_1.11 99.75,67.78 105.35,73.39 132.21,73.39 137.89,67.7 137.89,65.39
OR_OUT_CD: length 39
  Top Layer w0.254: 130.24,60.29 130.24,55.29 ; 130.66,65.39 130.3,65.75 130.3,66.78 128.52,68.56 108.66,68.56 107.44,67.35 107.44,64.64 107,64.2 ; 130.24,65.63 130.24,60.63
OR_OUT_EF: length 44.4
  Top Layer w0.254: 122.62,55.29 122.62,60.29 ; 122.35,54.65 122.68,54.32 122.68,52.5 118.06,47.88 103.33,47.88 97.21,54 OR_74hc32_1.3 ; 122.62,60.63 122.62,65.63
OR_OUT_GH: length 24.3
  Top Layer w0.254: 115,60.63 115,65.63 ; 114.73,54.65 112.38,52.3 105.63,52.3 104.83,53.11 OR_74hc32_1.6 ; 115,55.29 115,60.29
RST: length 136.1
  Bottom Layer w0.254: EXPANSION0-16-8.1 EXPANSION0-16-7.1 EXPANSION0-16-5.1 EXPANSION0-16-6.1 96.76,10.81
RW: length 134.2
  Bottom Layer w0.254: EXPANSION0-16-8.3 EXPANSION0-16-7.3 101.08,139.95 101.08,15.81 ; EXPANSION0-16-5.3 EXPANSION0-16-6.3

## Copper pours and planes (outline as drawn; the poured copper is in the pictures)
5V on 5V: 0.26,159.74 159.74,159.74 159.74,0.26 0.26,0.26
GROUND on GROUND: 0.26,159.74 159.74,159.74 159.74,0.26 0.26,0.26

Small or netless copper shapes (teardrops, artwork), in the pictures only: 160 on GROUND, 160 on 5V

## Text on the board
Bottom Silkscreen Layer: v03_01_GLUE_LOGIC_4Plane
Top Silkscreen Layer: A0 | A1 | A2 | A8 | A9 | A10 | 5v | IN_D | OUT_D | IN_A | OUT_A | IN_E | OUT_EF | IN_B | OUT_E | OUT_AB | IN_G | IN_F | IN_H | OUT_B | OUT_F | IN_C | OUT_C | GROUND | D0 | D1 | D2 | RST | CLOCK | /RW | E8 | E9 | E10 | ADDRESS BUS | DATA BUS | EXPANSION BUS | 5V | A3 | A4 | A5 | A6 | A7 | A11 | A12 | A13 | A14 | A15 | OUT_GH | OUT_CD | D3 | D4 | D5 | D6 | D7 | E3 | E4 | E5 | E6 | E7 | E11 | E12 | E13 | E14 | E15 | NAND 74HC00 | NOT 74HC04 | AND 74HC08 | OR 74HC32 | PIN1 | NOT HEADER | NAND HEADER | OR HEADER | AND HEADER
